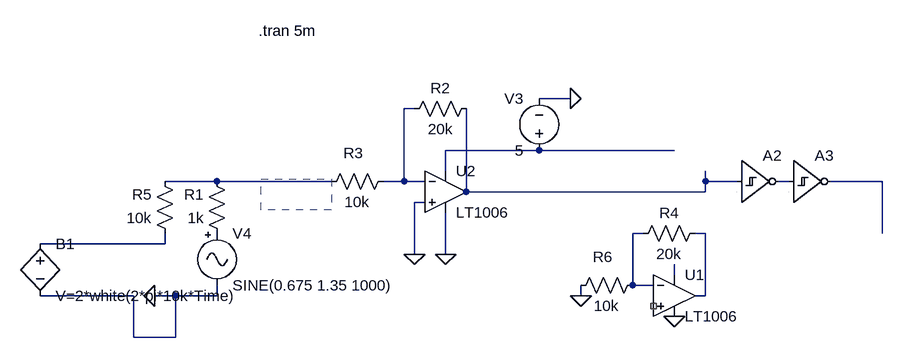
[diagram p0: schematic Noise.asc]
Noise.asc, the LTspice schematic file:
Version 4
SHEET 1 1060 872
WIRE 544 0 496 0
WIRE 304 16 288 16
WIRE 496 80 352 80
WIRE 704 80 496 80
WIRE 352 112 352 80
WIRE 0 128 -80 128
WIRE 176 128 0 128
WIRE 288 128 288 16
WIRE 288 128 256 128
WIRE 320 128 288 128
WIRE 752 128 752 112
WIRE 800 128 752 128
WIRE 880 128 864 128
WIRE 1024 128 944 128
WIRE 384 144 384 16
WIRE 752 144 752 128
WIRE 752 144 384 144
WIRE 320 160 304 160
WIRE 656 208 640 208
WIRE 752 208 736 208
WIRE 1024 208 1024 128
WIRE -80 224 -80 208
WIRE -80 224 -272 224
WIRE 304 240 304 160
WIRE 352 240 352 176
WIRE 704 272 704 256
WIRE 640 288 640 208
WIRE 672 288 640 288
WIRE -128 304 -272 304
WIRE -64 304 -96 304
WIRE 0 304 0 288
WIRE 0 304 -64 304
WIRE 560 304 560 288
WIRE 752 304 752 208
WIRE 752 304 736 304
WIRE -128 368 -128 304
WIRE -64 368 -64 304
WIRE -64 368 -128 368
FLAG 544 0 0
FLAG 352 240 0
FLAG -96 304 0
FLAG 304 240 0
FLAG 704 336 0
FLAG 560 304 0
SYMBOL voltage 496 96 R180
WINDOW 0 24 96 Left 2
WINDOW 3 24 16 Left 2
SYMATTR InstName V3
SYMATTR Value 5
SYMBOL res 288 32 R270
WINDOW 0 32 56 VTop 2
WINDOW 3 0 56 VBottom 2
SYMATTR InstName R2
SYMATTR Value 20k
SYMBOL LT1006 352 80 R0
SYMATTR InstName U2
SYMBOL res 272 112 R90
WINDOW 0 -12 62 VBottom 2
WINDOW 3 32 56 VTop 2
SYMATTR InstName R3
SYMATTR Value 10k
SYMBOL schmtinv 800 64 R0
SYMATTR InstName A2
SYMBOL signal 0 192 R0
SYMATTR InstName V4
SYMATTR Value SINE(0.675 1.35 1000)
SYMBOL res -64 224 R180
WINDOW 0 36 76 Left 2
WINDOW 3 36 40 Left 2
SYMATTR InstName R5
SYMATTR Value 10k
SYMBOL res 16 224 R180
WINDOW 0 36 76 Left 2
WINDOW 3 36 40 Left 2
SYMATTR InstName R1
SYMATTR Value 1k
SYMBOL schmtinv 880 64 R0
SYMATTR InstName A3
SYMBOL LT1006 704 240 R0
SYMATTR InstName U1
SYMBOL res 640 224 R270
WINDOW 0 32 56 VTop 2
WINDOW 3 0 56 VBottom 2
SYMATTR InstName R4
SYMATTR Value 20k
SYMBOL res 656 272 R90
WINDOW 0 -12 62 VBottom 2
WINDOW 3 32 56 VTop 2
SYMATTR InstName R6
SYMATTR Value 10k
SYMBOL bv -272 208 R0
SYMATTR InstName B1
SYMATTR Value V=2*white(2*pi*10k*Time)
TEXT 64 -104 Left 2 !.tran 5m
RECTANGLE Normal 176 172 68 124 2

The netlist it stands for:
* Noise.asc
V3 N002 0 5
R2 N001 N004 20k
XU2 0 N001 N002 0 N004 LT1006  ; pins In+ In- V+ V- OUT
R3 N001 N003 10k
A2 N004 0 0 0 0 N005 0 0 SCHMITT
V4 P001 0 SINE(0.675 1.35 1000)
R5 N009 N003 10k
R1 P001 N003 1k
A3 N005 0 0 0 0 N006 0 0 SCHMITT
XU1 NC_01 N007 N010 0 N008 LT1006  ; pins In+ In- V+ V- OUT
R4 N007 N008 20k
R6 N007 0 10k
B1 N009 0 V=2*white(2*pi*10k*Time)
.tran 5m
.lib LTC.lib
.backanno
.end